# EAGLE design USB-C (EAGLE 9.3.2)
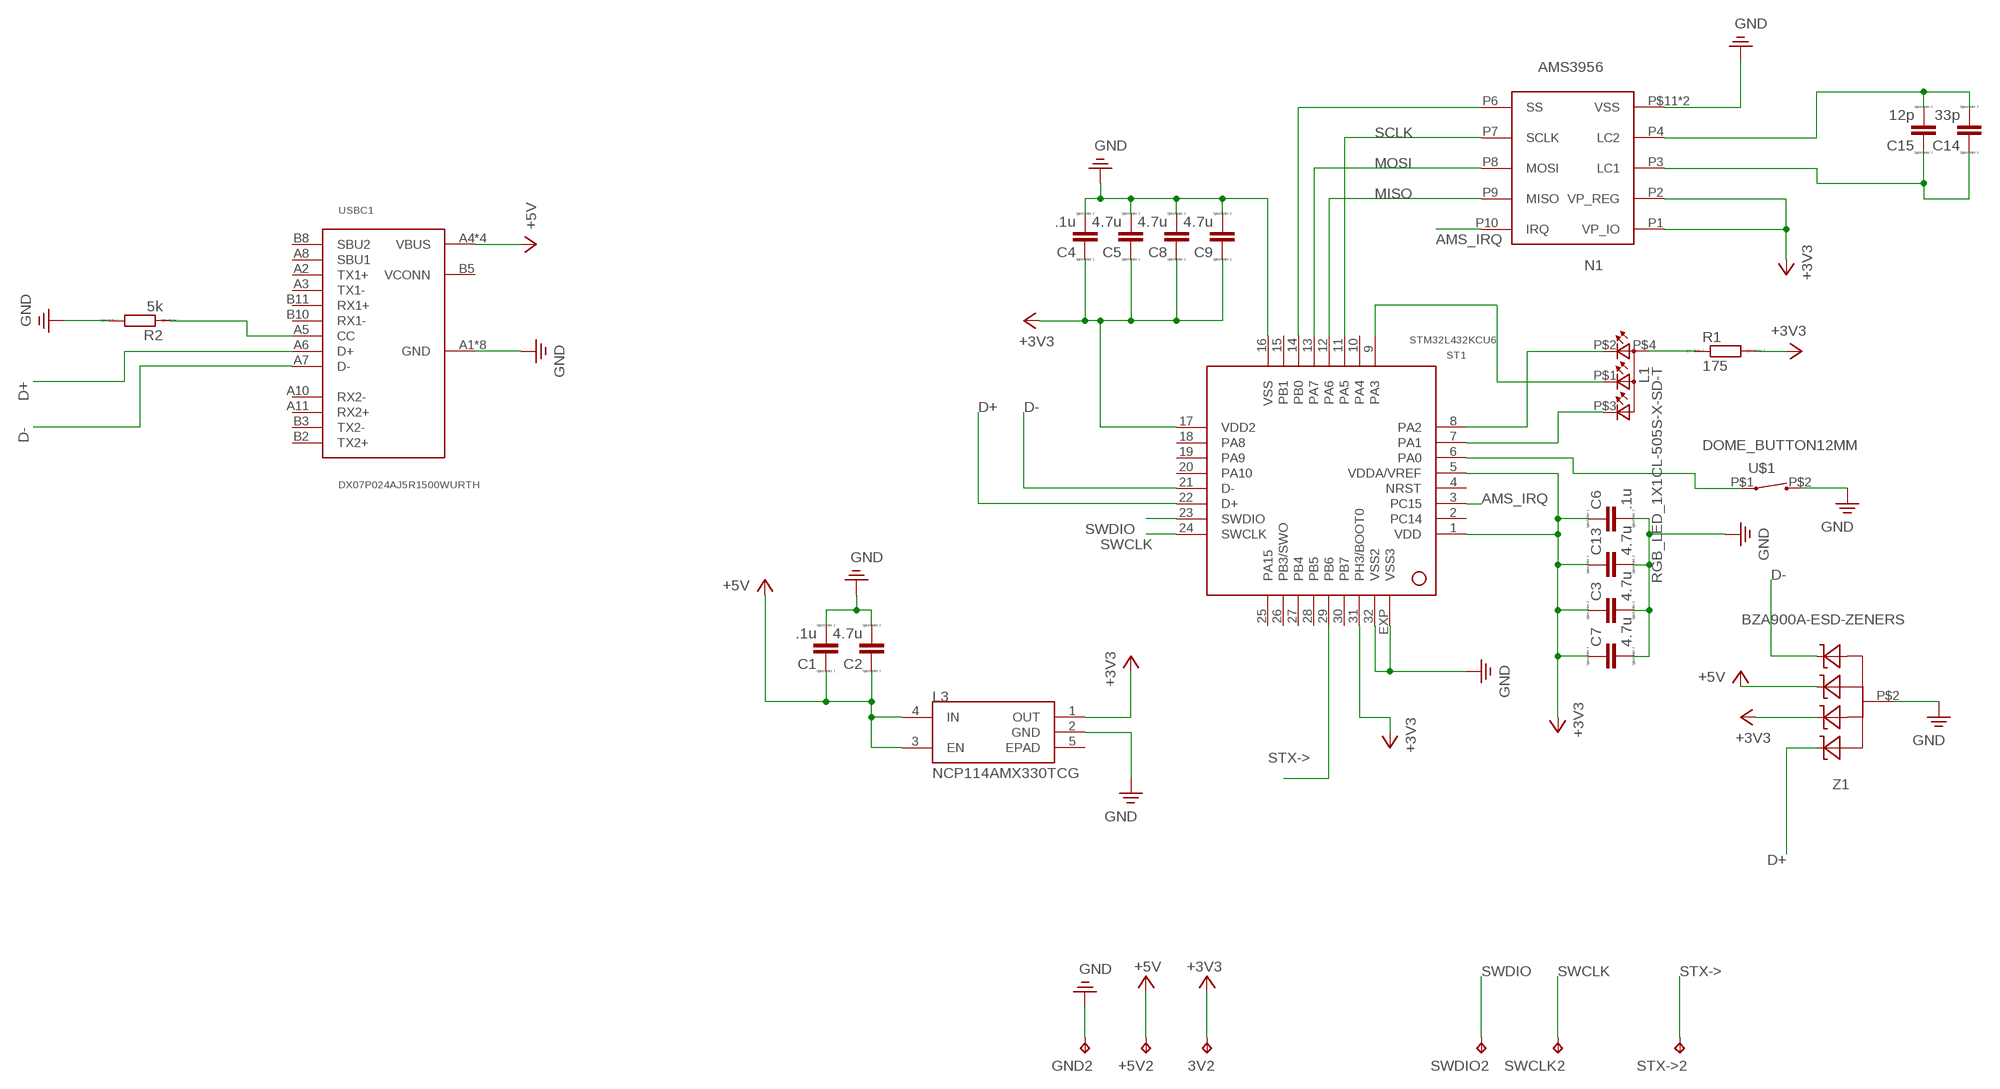
[diagram p0: schematic, sheet 1]

## Parts
3V2  TEST_POINT  [B1,27]
+5V2  TEST_POINT  [B1,27]
C1  .1u  CAPACITOR  [C0402]
C2  4.7u  CAPACITOR  [C0402]
C3  4.7u  CAPACITOR  [C0402]
C4  .1u  CAPACITOR  [C0402]
C5  4.7u  CAPACITOR  [C0402]
C6  .1u  CAPACITOR  [C0402]
C7  4.7u  CAPACITOR  [C0402]
C8  4.7u  CAPACITOR  [C0402]
C9  4.7u  CAPACITOR  [C0402]
C13  4.7u  CAPACITOR  [C0402]
C14  33p  CAPACITOR  [C0402]
C15  12p  CAPACITOR  [C0402]
GND2  TEST_POINT  [B1,27]
L1  RGB_LED_1X1CL-505S-X-SD-T  [CL-505S-X-SD-T]
L3  NCP114AMX330TCG  [REG_NCP114AMX330TCG]
N1  AMS3956  [MLPD3X3]
R1  175  RESISTOR  [R0402]
R2  5k  RESISTOR  [R0402]
ST1  STM32L432KCU6  [QFN32]
STX->2  TEST_POINT  [B1,27]
SWCLK2  TEST_POINT  [B1,27]
SWDIO2  TEST_POINT  [B1,27]
U$1  DOME_BUTTON12MM  [DOME-BL-12MM]
USBC1  DX07P024AJ5R1500WURTH  [WüRTH_632712000112]
Z1  BZA900A-ESD-ZENERS  [BZA900A]

## Nets
+3V3: 3V2.TP C3.1 C4.1 C5.1 C6.1 C7.1 C8.1 C9.1 C13.1 L3.1(OUT) N1.P1(VP_IO) N1.P2(VP_REG) R1.2 ST1.1(VDD) ST1.5(VDDA/VREF) ST1.17(VDD2) ST1.31(PH3/BOOT0) Z1.P$5(C1)
+5V: +5V2.TP C1.1 C2.1 L3.3(EN) L3.4(IN) USBC1.A4(VBUS) USBC1.A9(VBUS) USBC1.B4(VBUS) USBC1.B9(VBUS) Z1.P$1(C)
AMS_CS1: N1.P6(SS) ST1.14(PB0)
AMS_IRQ: N1.P10(IRQ) ST1.3(PC15)
D+: ST1.22(D+) USBC1.A6(D+) Z1.P$3(C3)
D-: ST1.21(D-) USBC1.A7(D-) Z1.P$4(C2)
MISO: N1.P9(MISO) ST1.12(PA6)
MOSI: N1.P8(MOSI) ST1.13(PA7)
N$1: R2.1 USBC1.A5(CC)
N$2: L1.P$4(A2) R1.1
N$3: L1.P$2(CRED) ST1.8(PA2)
N$4: L1.P$1(CBLUE) ST1.9(PA3)
N$5: L1.P$3(CGREEN) ST1.7(PA1)
N$6: ST1.6(PA0) U$1.P$1
N$8: C14.2 C15.2 N1.P4(LC2)
N$9: C14.1 C15.1 N1.P3(LC1)
PE: C1.2 C2.2 C3.2 C4.2 C5.2 C6.2 C7.2 C8.2 C9.2 C13.2 GND2.TP L3.2(GND) N1.P5(VSS) N1.P$11(VSS) R2.2 ST1.16(VSS) ST1.32(VSS2) ST1.EXP(VSS3) U$1.P$2 USBC1.A1(GND) USBC1.A12(GND) USBC1.B1(GND) USBC1.B12(GND) USBC1.P_GND1(GND) USBC1.P_GND2(GND) USBC1.P_GND3(GND) USBC1.P_GND4(GND) Z1.P$2 ; supply symbol labelled GND
SCLK: N1.P7(SCLK) ST1.11(PA5)
STX->: ST1.29(PB6) STX->2.TP
SWCLK: ST1.24(SWCLK) SWCLK2.TP
SWDIO: ST1.23(SWDIO) SWDIO2.TP
Unconnected: L3.5(EPAD) ST1.2(PC14) ST1.4(NRST) ST1.10(PA4) ST1.15(PB1) ST1.18(PA8) ST1.19(PA9) ST1.20(PA10) ST1.25(PA15) ST1.26(PB3/SWO) ST1.27(PB4) ST1.28(PB5) ST1.30(PB7) USBC1.A2(TX1+) USBC1.A3(TX1-) USBC1.A8(SBU1) USBC1.A10(RX2-) USBC1.A11(RX2+) USBC1.B2(TX2+) USBC1.B3(TX2-) USBC1.B5(VCONN) USBC1.B8(SBU2) USBC1.B10(RX1-) USBC1.B11(RX1+)

## Library data of the parts
3V2 +5V2 GND2 STX->2 SWCLK2 SWDIO2 = efm-fido:TEST_POINT
C1-C9 C13-C15 = efm-fido:CAPACITOR
L1 = efm-fido:RGB_LED_1X1: EAST1616RGBA3
L3 = efm-fido:NCP114AMX330TCG: CMOS Low Dropout Regulator, 300 mA 3.3V, Active Discharge; AVAILABILITY: Unavailable; DESCRIPTION: CMOS Low Dropout Regulator _LDO_, 300 mA 3.3V, Active Discharge; MF: ON Semiconductor; MP: NCP114AMX330TCG; PACKAGE: UDFN-4 ON Semiconductor; PRICE: None
N1 = efm-fido:AMS3956
R1 R2 = efm-fido:RESISTOR
ST1 = efm-fido:STM32L432KCU6
U$1 = efm-fido:DOME_BUTTON
USBC1 = efm-fido:DX07P024AJ5R1500
Z1 = efm-fido:BZA900A-ESD-ZENERS

## Net classes
0 default: width 0.152 mm, drill 0.203 mm, clearance 0.102 mm

## Board
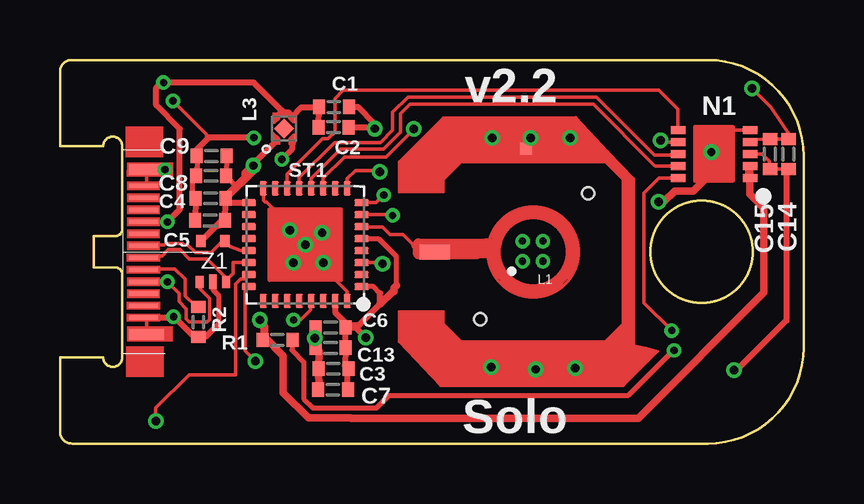
[diagram p1: board, top side]
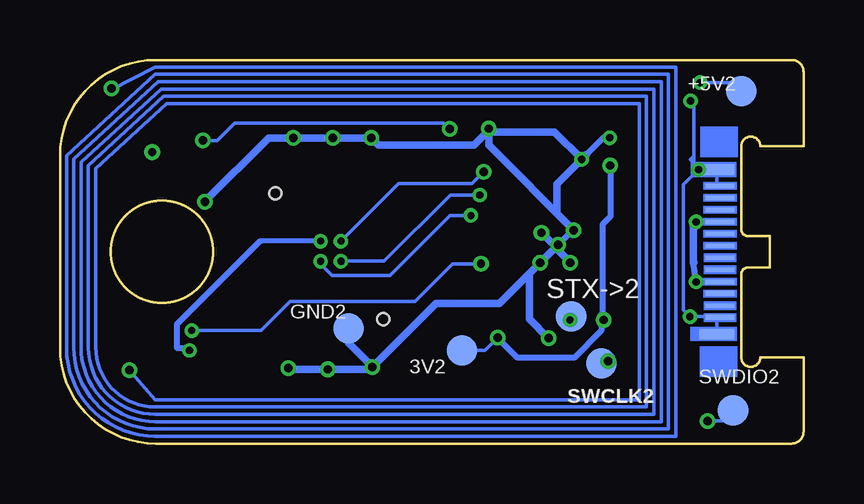
[diagram p2: board, bottom side, seen from below]

Size 31 x 16 mm. Coordinates in mm from the lower left corner, seen from the top.
Outline: 27,16 0.5,16 arc90 0,15.5 0,12.4 1.8,12.4 arc-180 2.6,12.4 2.6,8.95 arc-90 2.3,8.65 1.4,8.65 1.4,7.35 2.3,7.35 arc-90 2.6,7.05 2.6,3.6 arc-180 1.8,3.6 0,3.6 0,0.5 arc90 0.5,0 27,0 arc90 31,4 31,12 arc90 27,16
Outline: circle at 26.75,8 radius 2.12
Copper layers (1*16): Top 0.035mm / dielectric 0.8mm / Bottom 0.035mm
Design rules "default *": minimum track width 4mil, minimum drill 0.2mm, track to track 4mil, track to pad 4mil, pad to pad 4mil, via to via 6mil, smd to smd 4mil, copper to edge 4mil, drill to drill 6mil, minimum pad ring 4mil, minimum via ring 0.15mm, stop-mask expansion 4mil, vias tented up to drill 0mil, thermal gap 10mil
Holes 0.5 mm at 22.03,10.44 17.53,5.19

### Footprints (pad centres in the part's own frame; a part is rotated, then mirrored left to right if it is on the bottom)
B1,27 = smd 1.27 x 1.27: TP 0,0
C0402 = smd 0.5 x 0.6: 1 -0.625,0; 2 0.625,0
CL-505S-X-SD-T = smd 0.4 x 0.4: P$1 0.85,0; P$2 0.85,0.85; P$3 0,0.85; P$4 0,0
REG_NCP114AMX330TCG = smd 0.1 x 0.1: 1 -0.325,-0.5; 2 0.325,-0.5; 3 0.325,0.5; 4 -0.325,0.5 | smd 0.58 x 0.58 rotated 45: 5 0,0
MLPD3X3 = smd 0.6 x 0.35: P1 0,-0.54; P2 0,-1.04; P3 0,-1.54; P4 0,-2.04; P5 0,-2.54; P6 3,-2.54; P7 3,-2.04; P8 3,-1.54; P9 3,-1.04; P10 3,-0.54 | smd 0.2 x 0.2: P$11 1.6,-1.64
R0402 = smd 0.5 x 0.6: 1 -0.625,0; 2 0.625,0
QFN32 = smd 0.6 x 0.3: 1 -2.35,1.75; 2 -2.35,1.25; 3 -2.35,0.75; 4 -2.35,0.25; 5 -2.35,-0.25; 6 -2.35,-0.75; 7 -2.35,-1.25; 8 -2.35,-1.75; 17 2.35,-1.75; 18 2.35,-1.25; 19 2.35,-0.75; 20 2.35,-0.25; 21 2.35,0.25; 22 2.35,0.75; 23 2.35,1.25; 24 2.35,1.75 | smd 0.3 x 0.6: 9 -1.75,-2.35; 10 -1.25,-2.35; 11 -0.75,-2.35; 12 -0.25,-2.35; 13 0.25,-2.35; 14 0.75,-2.35; 15 1.25,-2.35; 16 1.75,-2.35; 25 1.75,2.35; 26 1.25,2.35; 27 0.75,2.35; 28 0.25,2.35; 29 -0.25,2.35; 30 -0.75,2.35; 31 -1.25,2.35; 32 -1.75,2.35 | smd 0.2 x 0.2: EXP 0,0
DOME-BL-12MM = smd 1.27 x 0.635: P$1 -4.1,0 | smd 0.5 x 0.5: P$2 -0.3,4.3
WüRTH_632712000112 = smd 0.2 x 1.2: A1 5.651,1.017; A2 5.152,1.021; A3 4.649,1.023; A4 4.161,1.021; A5 3.653,1.021; A6 3.157,1.021; A7 2.655,1.017; A8 2.156,1.017; A9 1.655,1.021; A10 1.159,1.023; A11 0.655,1.016; A12 0.155,1.019 | smd 0.2 x 1.2 bottom: B1 0.155,1.019; B2 0.652,1.019; B3 1.158,1.023; B4 1.655,1.021; B5 2.155,1.017; B6 2.658,1.014; B7 3.155,1.021; B8 3.655,1.019; B9 4.16,1.019; B10 4.645,1.021; B11 5.157,1.023; B12 5.646,1.015 | smd 0.45 x 1.45 bottom: P_GND1 -0.524,1.146; P_GND2 6.34,1.146 | smd 0.45 x 1.45: P_GND3 6.354,1.146; P_GND4 -0.523,1.146
BZA900A = smd 0.325 x 0.5: P$1 -0.05,0; P$3 1.05,0 | smd 0.3 x 0.6: P$2 0.5,0 | smd 0.4 x 0.5: P$4 1,1.7; P$5 0,1.7

### Placement (x,y rotation side)
3V2  14.24,3.89 0 bottom
+5V2  2.6,14.7 0 bottom
C1  11.42,14.03 0 top
C2  11.41,13.19 0 top
C3  11.4,3.12 180 top
C4  6.28,10.23 180 top
C5  6.26,9.3 180 top
C6  11.28,4.84 180 top
C7  11.38,2.25 180 top
C8  6.31,11.16 180 top
C9  6.32,11.99 180 top
C13  11.28,3.99 180 top
C14  .5p  [C0402]  30.37,12.07 90 top
C15  .5p  [C0402]  29.6,12.07 90 top
GND2  18.98,4.79 0 bottom
L1  20.14,8.45 180 top
L3  9.35,13.13 0 top
N1  28.76,10.53 180 top
R1  9.07,4.32 180 top
R2  5.77,5.06 270 top
ST1  10.23,8.29 180 top
STX->2  9.69,5.3 0 bottom
SWCLK2  8.43,3.34 0 bottom
SWDIO2  2.94,1.38 0 bottom
U$1  19.73,7.99 0 top
USBC1  2.47,10.9 270 top
Z1  5.88,6.74 0 top

### Tracks (layer width: path | path; a pad name or v marks a point on that pad's centre or on a via)
+3V3  (via drill 0.35)
  Top 0.152: ST1.31 11.41,5.93 | 11.93,5.02 12.02,4.93 | C6.1 11.93,4.84 12.03,4.94 | N1.P2 28.74,11.57 28.72,11.59
  Top 0.2: C9.1 6.92,11.17 C8.1 7.33,10.74
  Top 0.203: 12.53,4.94 12.48,4.94 | 13.35,6.27 13.08,6.54 ST1.1 | ST1.5 13.28,8.54 14.03,7.79 14.03,6.59
  Top 0.254: 8.32,4.22 R1.2 8.47,4.83 8.53,4.89 8.53,4.95 v8.33,5.15 | C5.1 6.9,10.12 C4.1 | C4.1 7.12,10.04 ST1.17 | C4.1 6.96,10.23 | C4.1 6.96,10.23 8.06,11.33 v8.06,11.59 | 6.48,9.05 6.88,9.22 C5.1 | C4.1 6.88,10.29 7.33,10.74 7.68,11.09 7.68,11.29 L3.1 | 13.35,6.27 13.35,5.82 12.48,4.94 12.03,4.94 | 12.02,4.93 11.98,4.89 C6.1 | C6.1 12.33,4.84 v12.76,4.41 | C6.1 C13.1 11.88,3.24 C3.1 11.98,3.1 C7.1 | Z1.P$5 6.74,9.3 C5.1 | ST1.31 11.48,5.47 11.93,5.02
  Top 0.305: 13.35,5.82 13.88,6.34 13.93,6.34 13.93,6.49 14.03,6.59 | 8.53,4.89 8.53,4.44 9.31,3.66 9.31,2.12 10.36,1.07 12.11,1.07 12.13,1.05 24.11,1.05 29.35,6.29 29.35,9.82 28.76,10.41 N1.P1 N1.P2 | 28.72,11.59 28.72,11.12
  Bottom 0.152: v12.76,4.41 13.28,3.89 14.44,3.89
  Bottom 0.25: 9.56,3.58 11.92,3.58 v12.76,4.41
  Bottom 0.254: 9.56,3.58 8.43,4.71 8.43,5.15 v8.33,5.15 | 14.44,3.89 3V2.TP | v8.06,11.59 8.06,9.46 8.38,9.14 8.38,5.4
  Bottom 0.305: v8.33,5.15 8.38,5.4
+5V  (via drill 0.3)
  Top 0.152: Z1.P$1 5.83,6.47 6.25,6.05 6.25,5.18 6.14,5.08 5.39,5.08 5.27,5.2 5.27,5.62 4.96,5.93 4.96,6.26 v4.48,6.75 | v4.48,9.24 USBC1.B4 | 3.8,6.74 4.18,6.74 | 4.18,6.74 4.18,6.75 | 3.8,6.74 3.8,6.75 v4.48,6.75 | 3.26,6.74 USBC1.B9 3.8,6.74 | 4.18,6.74 v4.48,6.74 v4.48,6.75
  Top 0.2: v4.48,6.75 4.18,6.75 4.17,6.75
  Top 0.203: 10.76,14.02 C1.1
  Top 0.25: L3.4 9.22,13.83 9.22,13.91 | 9.32,13.82 9.52,13.82 9.67,13.66 L3.3 10.06,14.02 10.76,14.02 | C2.1 C1.1 | USBC1.B4 3.34,9.25 3.33,9.24 | 4.72,9.48 v4.48,9.24 5,9.76 5,13.12 4.02,14.1 4.02,14.84 4.23,15.05 | 4.95,15.05 v4.32,15.05
  Top 0.254: 9.27,13.87 9.2,13.8 | 9.32,13.82 9.27,13.87 | 9.27,13.87 9.22,13.91 8.08,15.05 4.95,15.05 | 4.76,15.05 v4.32,15.05 4.23,15.05 4.19,15.05 | 3.26,6.74
  Bottom 0.152: 3.15,14.7 +5V2.TP 2.95,15.05 v4.32,15.05 | 4.59,9.25 USBC1.B4 v4.48,9.24 | 3.26,6.74 USBC1.B9 4.05,6.74 | 3.26,6.74 | 3.26,6.74 3.26,6.75 4.21,6.75 | 4.05,6.74 4.21,6.74 4.21,6.75 | 4.21,6.75 v4.48,6.75 4.05,6.75 4.05,6.74
  Bottom 0.2: 4.05,6.74 4.16,6.74
  Bottom 0.254: v4.48,6.75 4.59,7.53
  Bottom 0.305: 4.59,9.25 4.59,7.53 4.57,7.54
AMS_CS1
  Top 0.152: ST1.14 9.48,11.24 10.95,12.72 11.18,12.72 11.46,12.99 11.46,14.4 11.81,14.74 24.97,14.74 25.76,13.95 N1.P6
AMS_IRQ  (via drill 0.3, 0.35)
  Top 0.152: v25.51,4.71 24.35,5.87 24.35,10.44 24.98,11.07 N1.P10 | v13.45,7.49 13.4,7.54 ST1.3
  Bottom 0.152: v25.51,4.71 22.61,4.71 21.4,5.92 16.21,5.92 14.64,7.49 v13.45,7.49
D+
  Top 0.152: ST1.22 7.23,7.54 7.23,7.09 6.93,6.79 Z1.P$3 | Z1.P$3 6.96,6.74 | Z1.P$3 7.01,6.83 6.13,7.7 5.39,7.7 5.01,8.09 4.52,8.09 4.26,7.82 3.57,7.82 USBC1.A6 3.49,7.83
D-
  Top 0.152: ST1.21 7.52,8.04 7.1,8.22 Z1.P$4 6.78,8.44 6.29,7.96 5.65,7.96 5.33,8.28 5.17,8.28 5.11,8.34 4.41,8.34 4.35,8.28 3.64,8.28 3.58,8.34 USBC1.A7 3.49,8.24
MISO
  Top 0.152: ST1.12 10.48,11.06 11.69,12.27 13.49,12.27 14.2,12.99 14.2,13.76 14.59,14.15 22.23,14.15 24.76,11.62 24.81,11.57 N1.P9
MOSI
  Top 0.152: N1.P8 25.72,12.03 24.79,12.03 22.37,14.45 14.51,14.45 13.87,13.81 13.87,13.07 13.36,12.56 11.45,12.56 9.98,11.08 ST1.13
N$1
  Top 0.152: 3.58,7.16 USBC1.A5 3.53,7.29 4.78,7.29 5.22,6.85 5.22,6.16 5.63,5.75 5.77,5.75 R2.1
N$2  (via drill 0.3)
  Top 0.152: L1.P$4 v20.14,8.44
  Top 0.2: R1.1 9.67,3.89 10.16,3.39 10.16,1.87 10.55,1.48 13.21,1.48 13.72,2
  Top 0.203: 25.54,4.06 25.61,3.99 v25.61,3.88 25.59,3.9 23.7,2 13.72,2
  Bottom 0.152: v20.14,8.44 v20.13,8.44
  Bottom 0.2: v20.13,8.44 22.65,8.44
  Bottom 0.254: v25.61,3.88 25.61,3.99 26.13,3.99 26.13,4.96 22.65,8.44
N$3  (via drill 0.3)
  Top 0.152: ST1.8 13.18,10.04 v13.5,10.36
  Bottom 0.152: v13.5,10.36 13.58,10.36 | v13.5,10.36 13.5,10.31 | L1.P$2 17.49,7.6 14.73,10.36 v13.5,10.36
  other vias: 19.29,7.6
N$4  (via drill 0.3, 0.35)  (1 unrouted)
  Top 0.152: v13.33,11.33 13.33,11.39 12.33,11.39 11.98,11.04 ST1.9
  Bottom 0.152: v13.33,11.33 13.82,10.84 16.89,10.84 v19.29,8.44
N$5  (via drill 0.3)
  Top 0.152: ST1.7 13.87,9.54 v13.87,9.51
  Bottom 0.152: v13.87,9.51 14.74,9.51 17.25,7 19.66,7 20.14,7.48 L1.P$3
  other vias: 20.14,7.6
N$6
  Top 0.152: ST1.6 12.55,9.02 13.45,9.02 13.75,8.71 14.3,8.71 14.77,8.24 15.64,8.24 | 14.93,7.94 14.95,7.96 15,7.96 15.05,7.96 15.02,7.99 | U$1.P$1 15.02,7.99 | 15.02,7.99 15,8.02
  Top 0.254: 14.77,8.24 15,8.02 15,7.96
N$7
  Bottom 0.15: 28.86,14.76 27.03,15.7 5.33,15.7 5.33,0.3 27.03,0.3 arc90 30.73,4 30.73,12 27.03,15.4 5.63,15.4 5.63,0.61 27.03,0.61 arc90 30.42,4 30.42,11.87 26.91,15.09 5.94,15.09 5.94,0.91 27.03,0.91 arc90 30.12,4 30.12,11.74 26.79,14.79 6.24,14.79 6.24,1.22 27.03,1.22 arc90 29.81,4 29.81,11.6 26.67,14.49 6.55,14.49 6.55,1.52 27.03,1.52 arc90 29.51,4 29.51,11.47 26.55,14.18 6.85,14.18 6.85,1.83 27.03,1.83 28.13,3.09
N$8  (via drill 0.35)
  Top 0.152: 28.79,12.57 N1.P4 28.86,12.67 C15.2 | C15.2 30.54,12.67 29.63,14.03 v28.86,14.8 | 29.74,12.53 C15.2 | C14.2 C15.2
N$9  (via drill 0.35)
  Top 0.152: N1.P3 29.27,12.08 29.58,11.77 29.58,11.49 C15.1 C14.1 30.29,11.39
  Top 0.25: 30.29,11.39 30.29,5.13 28.27,3.11 28.16,3.11 v28.11,3.06
PE  (via drill 0.3, 0.35)
  Top 0.152: ST1.32 11.98,6.34 10.53,7.79 10.53,7.99 | ST1.16 8.5,10.57 8.5,10.13 8.56,10.07 8.61,10.07 10.23,8.44 ST1.EXP | C13.2 v10.63,4.39 | N1.P5 27.73,13.07 27.73,12.65 27.39,12.32 | v24.97,10.08 v24.97,10.09 | 27.13,12.06 27.21,12.13 | 27.21,12.13 27.23,12.15 | USBC1.A12 3.61,10.88 USBC1.P_GND1 v4.37,11.43 | USBC1.P_GND3 3.61,5.12 USBC1.A1 | 27.21,12.13 N1.P$11 27.31,12.32 27.39,12.32 | 27.39,12.32 27.23,12.15 | 27.23,12.15 v27.16,12.15 | 5.57,12.08 5.72,11.93 | v4.71,14.29 6.11,12.89 6.11,12.67
  Top 0.2: C9.2 5.72,11.93 5.72,11.39 5.72,11.17 C8.2 5.52,10.97 5.52,10.27 5.52,10.07
  Top 0.203: Z1.P$2 6.38,6.41 6.61,6.18 6.61,4.98 6.4,4.77
  Top 0.25: C1.2 12.42,14.03 13.12,13.33 v13.12,13.13 13.06,13.19 C2.2 | v8.09,12.75 6.2,12.75 6.11,12.67 5.72,12.27 C9.2 | L3.2 9.67,12.28 v9.25,11.85 | v4.74,5.29 5.57,4.46 R2.2 6.09,4.46 6.4,4.77 | 6.4,6.72 Z1.P$2 | 5.68,11.43 5.72,11.39
  Top 0.254: v9.58,8.89 9.63,8.89 ST1.EXP 10.53,7.99 v10.98,7.54 | v10.93,8.79 9.73,8.79 v9.73,7.54 | v10.63,4.39 C6.2 | v9.25,11.85 9.11,12 | L3.2 9.74,12.63 | C5.2 5.66,10.21 C4.2 5.52,10.07 | 5.52,10.27 5.65,10.4 | v4.74,5.29 4.7,5.25 USBC1.A1
  Top 0.305: 5.54,10.36 C4.2 | U$1.P$2 19.63,12.49 v19.63,12.74 | v24.97,10.08 25.19,10.08 25.63,10.52 26.41,10.52 27.54,11.65 27.13,12.06 | N1.P$11 27.34,12.17 | C7.2 10.8,2.27 C3.2 10.8,3.87 C13.2
  Bottom 0.152: 3.69,5.26 USBC1.A1 USBC1.B12 | USBC1.A12 3.61,10.88 USBC1.P_GND1 v4.37,11.43 | v4.37,11.43 4.57,11.62 4.57,11.68 | 4.57,11.68 4.73,11.84 4.62,11.95 | 4.57,11.68 4.57,14.15 v4.71,14.29 | v4.37,11.43 5.01,10.79 5.01,5.56 v4.74,5.29 3.72,5.29 3.69,5.26 | USBC1.P_GND2 3.61,5.19 3.69,5.26
  Bottom 0.254: 3.48,10.73 USBC1.A12 | 10.33,8.29 ST1.EXP 9.63,8.89 v9.58,8.89 | v9.25,11.85 8.35,12.75 v8.09,12.75
  Bottom 0.305: 9.05,12.05 v9.25,11.85 | v9.25,11.85 10.38,12.98 12.97,12.98 v13.12,13.13 | v13.12,13.13 13.12,13.06 13.74,12.44 17.73,12.44 v18.03,12.74 v19.63,12.74 v21.28,12.74 22.31,12.74 v24.97,10.08 | v21.48,3.14 21.43,3.09 v19.83,3.09 18.08,3.09 v17.98,3.19 | v17.98,3.19 18.98,4.19 GND2.TP | v10.63,4.39 11.43,5.19 11.43,7.09 v10.98,7.54 | v10.98,7.54 ST1.EXP 10.23,8.04 v9.73,7.54 | v10.93,8.79 10.43,8.29 10.33,8.29 | v10.98,7.54 12.68,5.84 15.33,5.84 v17.98,3.19 | v13.12,13.13 13.12,12.44 v9.58,8.89 10.28,9.59 10.28,10.82 v9.25,11.85
  other vias: 10.23,8.29
SCLK  (via drill 0.35)
  Top 0.152: 25.7,12.63 N1.P7 25.21,12.57 25.14,12.64 v25.03,12.64 | ST1.11 10.98,11.07 11.87,11.96 13.59,11.96 v14.76,13.12
  Bottom 0.152: v25.03,12.64 24.44,12.64 23.73,13.36 15.01,13.36 v14.77,13.12 v14.76,13.12
STX->  (via drill 0.3)
  Top 0.152: ST1.29 10.46,5.93 10.46,5.58 10.04,5.16 v9.74,5.16 9.63,5.05
  Bottom 0.152: STX->2.TP v9.74,5.16
SWCLK  (via drill 0.35)
  Top 0.152: v8.14,3.43 7.72,3.86 7.72,6.39 ST1.24
  Bottom 0.152: v8.14,3.43 8.09,3.48
  Bottom 0.254: v8.14,3.43 8.23,3.34 SWCLK2.TP
SWDIO  (via drill 0.35)
  Top 0.152: ST1.23 7.71,6.87 7.53,6.87 7.32,6.66 7.32,2.87 5.39,2.87 4,1.48 v4,0.94
  Bottom 0.152: v4,0.94 3.38,0.94 SWDIO2.TP

### Text on the board
tPlace: v2.2 | Solo